# EAGLE board PinHeck (EAGLE 6.5.0), part 1 of 2
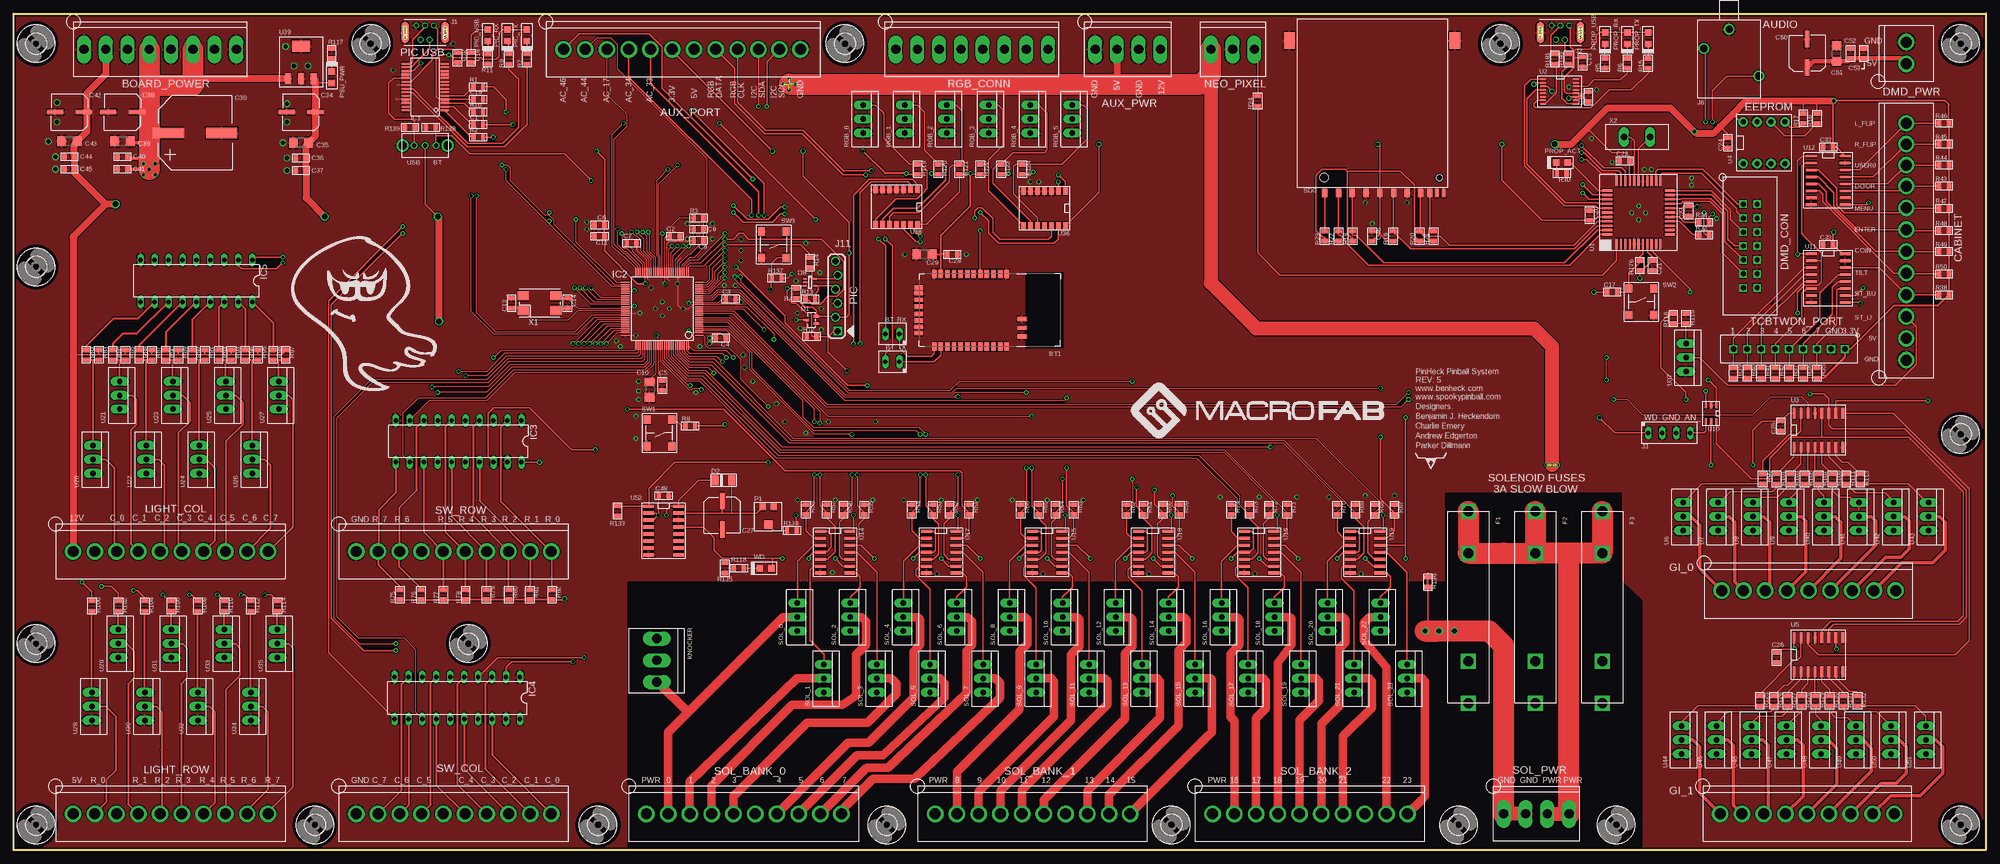
[diagram p10: board, top side]
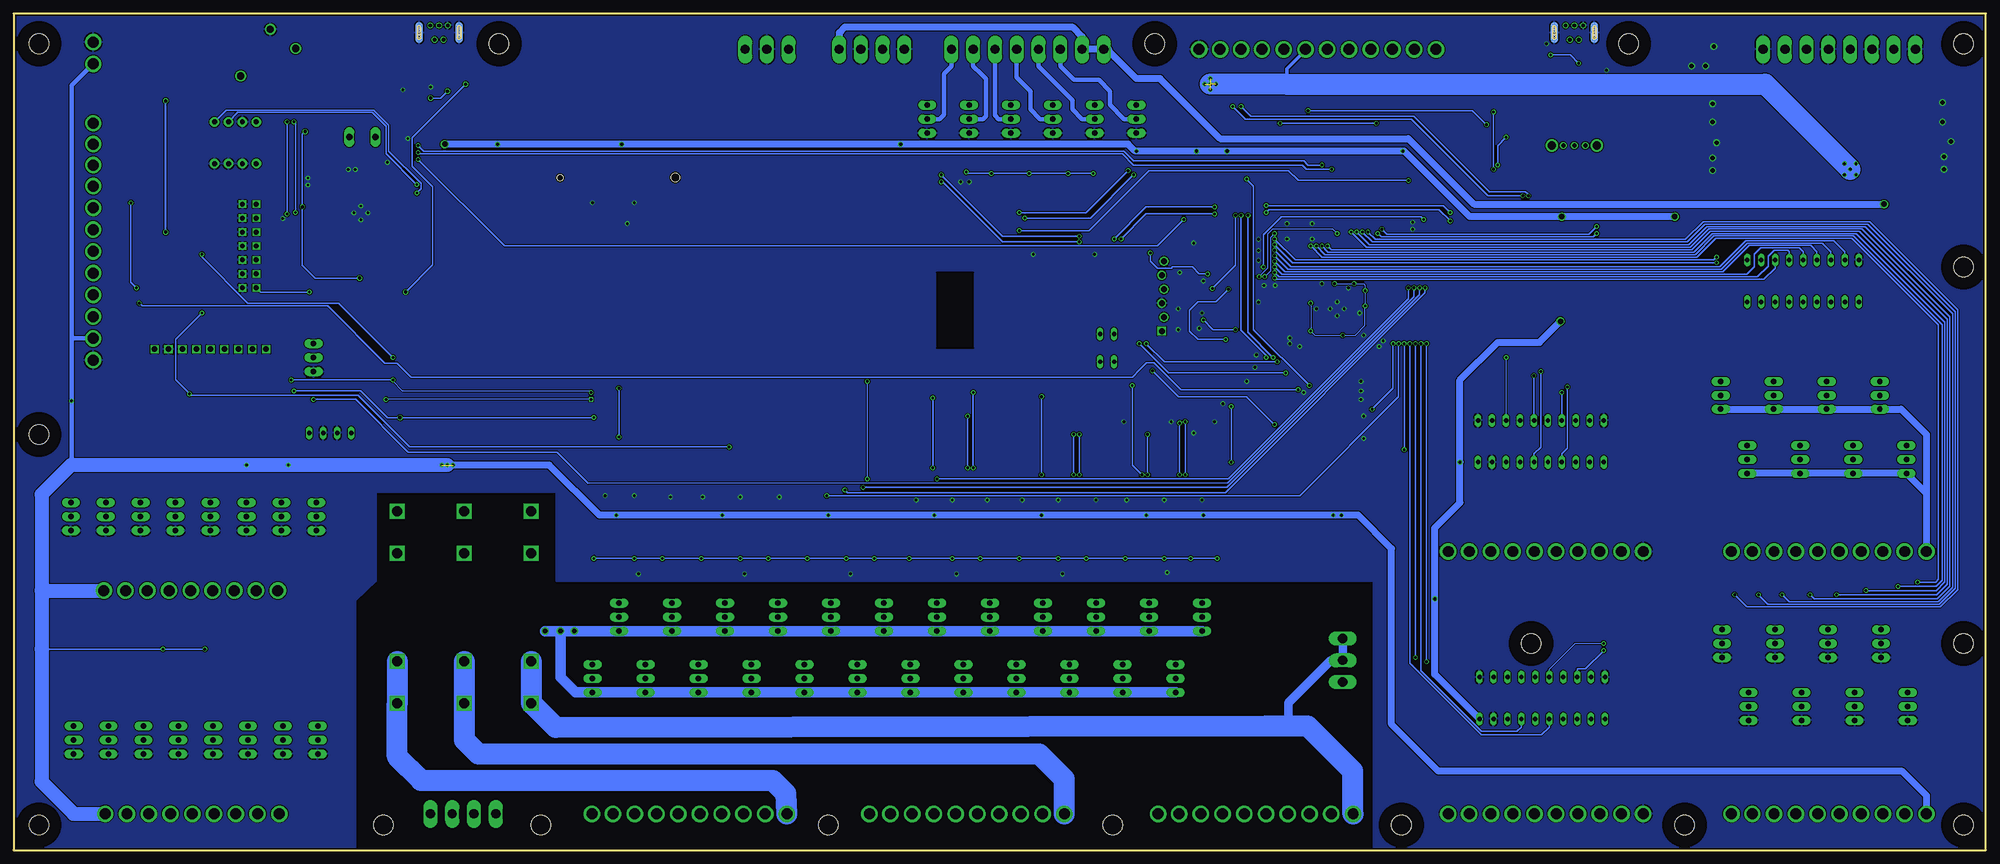
[diagram p11: board, bottom side, seen from below]

Size 359.16 x 152.27 mm. Coordinates in mm from the lower left corner, seen from the top.
Outline: 0,152.27 359.16,152.27 359.16,0 0,0 0,152.27
Copper layers (1*16): Top 0.035mm / dielectric 0.2mm / Bottom 0.035mm
Design rules "Seeed_2_Layer_DRU": minimum track width 6mil, minimum drill 12mil, track to track 6mil, track to pad 6mil, pad to pad 6mil, via to via 6mil, smd to smd 0mil, copper to edge 10mil, drill to drill 10mil, minimum pad ring 6mil, minimum via ring 6mil, stop-mask expansion 2mil, vias tented up to drill 25mil, thermal gap 10mil
Net classes: 0 default: width 0.178 mm, drill 0.5 mm, clearance 0.178 mm
tRestrict: area 184.4,91.4 to 191,105.2
bRestrict: area 184.4,91.4 to 191,105.2

## Footprints (pad centres in the part's own frame; a part is rotated, then mirrored left to right if it is on the bottom)
MOLEX_KK_12 = drill 2: P$1 -21.793,0; P$2 -17.831,0; P$3 -13.868,0; P$4 -9.906,0; P$5 -5.944,0; P$6 -1.981,0; P$7 1.981,0; P$8 5.944,0; P$9 9.906,0; P$10 13.716,0; P$11 17.526,0; P$12 21.336,0
MOLEX_KK_4 = drill 1.702 long: 1 -6.248,0; 2 -2.286,0; 3 1.676,0; 4 5.639,0
MOLEX_KK_8 = drill 1.702 long: 1 -13.868,0; 2 -9.906,0; 3 -5.944,0; 4 -1.981,0; 5 1.981,0; 6 5.944,0; 7 9.906,0; 8 13.868,0
RN-41 = smd 0.8 x 1.6: 1 -2.79,-6.6; 2 -1.59,-6.6; 3 -0.39,-6.6; 4 0.81,-6.6; 5 2.01,-6.6; 6 3.21,-6.6; 7 4.41,-6.6; 8 5.61,-6.6; 9 6.81,-6.6; 10 8.01,-6.6; 11 9.21,-6.6; 12 10.41,-6.6; 13 10.41,6.6; 14 9.21,6.6; 15 8.01,6.6; 16 6.81,6.6; 17 5.61,6.6; 18 4.41,6.6; 19 3.21,6.6; 20 2.01,6.6; 21 0.81,6.6; 22 -0.39,6.6; 23 -1.59,6.6; 24 -2.79,6.6 | smd 1.6 x 0.8: 25 -5.59,4.8; 26 -5.59,3.2; 27 -5.59,1.6; 28 13.21,3.1; 29 13.21,-3.1; 30 13.21,-4.122; 31 13.21,-1.9; 32 13.21,-0.7; 33 13.21,0.7; 34 13.21,1.9; 35 13.21,4.122
HEADER_01X02_PTH = drill 0.8 long: 1 0,0; 2 2.54,0
0805 = smd 0.8 x 1.2: 1 -0.9,0; 2 0.9,0
1206 = smd 1.6 x 1.8: 1 -1.4,0; 2 1.4,0
6.3MM_CAP_SMD = smd 0.8 x 3: NEG 0,-2.6; POS 0,2.6
CP12.5MM = smd 2 x 5.7: P$1 0,-4.85; P$2 0,4.85
SOT-323 = smd 0.5 x 1: 1 -0.65,-0.9; 2 0.65,-0.9; 3 0,0.9
SOD-123 = smd 1.3 x 1.8: 1 -1.27,0; 2 1.73,0
SOT-323-5 = smd 0.4 x 0.6: 1 -0.65,-0.9; 2 0,-0.9; 3 0.65,-0.9; 4 0.65,0.9; 5 -0.65,0.9
HEADER_02X07_PTH = drill 0.9 square: 1 -7.62,-1.27; 2 -5.08,-1.27; 3 -2.54,-1.27; 4 0,-1.27; 5 2.54,-1.27; 6 5.08,-1.27; 7 7.62,-1.27; 8 7.62,1.27; 9 5.08,1.27; 10 2.54,1.27; 11 0,1.27; 12 -2.54,1.27; 13 -5.08,1.27; 14 -7.62,1.27
MOLEX_KK_2 = drill 2: P$1 -1.88,0; P$2 2.083,0
4245K = drill 1.8 square: 1A -17.465,0; 1B -9.845,0; 2A 17.465,0; 2B 9.845,0
MOLEX_KK_9 = drill 2: P$1 -15.85,0; P$2 -11.887,0; P$3 -7.925,0; P$4 -3.962,0; P$5 0,0; P$6 3.962,0; P$7 7.925,0; P$8 11.887,0; P$9 15.85,0
3,6 = hole 3.6: 0,0
SSOP28L = smd 0.4 x 1.5: 1 -4.225,-3.575; 2 -3.575,-3.575; 3 -2.925,-3.575; 4 -2.275,-3.575; 5 -1.625,-3.575; 6 -0.975,-3.575; 7 -0.325,-3.575; 8 0.325,-3.575; 9 0.975,-3.575; 10 1.625,-3.575; 11 2.275,-3.575; 12 2.925,-3.575; 13 3.575,-3.575; 14 4.225,-3.575; 15 4.225,3.575; 16 3.575,3.575; 17 2.925,3.575; 18 2.275,3.575; 19 1.625,3.575; 20 0.975,3.575; 21 0.325,3.575; 22 -0.325,3.575; 23 -0.975,3.575; 24 -1.625,3.575; 25 -2.275,3.575; 26 -2.925,3.575; 27 -3.575,3.575; 28 -4.225,3.575
TQ100-PT = smd 1.5 x 0.2: 1 -6.7,4.8; 2 -6.7,4.4; 3 -6.7,4; 4 -6.7,3.6; 5 -6.7,3.2; 6 -6.7,2.8; 7 -6.7,2.4; 8 -6.7,2; 9 -6.7,1.6; 10 -6.7,1.2; 11 -6.7,0.8; 12 -6.7,0.4; 13 -6.7,0; 14 -6.7,-0.4; 15 -6.7,-0.8; 16 -6.7,-1.2; 17 -6.7,-1.6; 18 -6.7,-2; 19 -6.7,-2.4; 20 -6.7,-2.8; 21 -6.7,-3.2; 22 -6.7,-3.6; 23 -6.7,-4; 24 -6.7,-4.4; 25 -6.7,-4.8; 51 6.7,-4.8; 52 6.7,-4.4; 53 6.7,-4; 54 6.7,-3.6; 55 6.7,-3.2; 56 6.7,-2.8; 57 6.7,-2.4; 58 6.7,-2; 59 6.7,-1.6; 60 6.7,-1.2; 61 6.7,-0.8; 62 6.7,-0.4; 63 6.7,0; 64 6.7,0.4; 65 6.7,0.8; 66 6.7,1.2; 67 6.7,1.6; 68 6.7,2; 69 6.7,2.4; 70 6.7,2.8; 71 6.7,3.2; 72 6.7,3.6; 73 6.7,4; 74 6.7,4.4; 75 6.7,4.8 | smd 0.2 x 1.5: 26 -4.8,-6.7; 27 -4.4,-6.7; 28 -4,-6.7; 29 -3.6,-6.7; 30 -3.2,-6.7; 31 -2.8,-6.7; 32 -2.4,-6.7; 33 -2,-6.7; 34 -1.6,-6.7; 35 -1.2,-6.7; 36 -0.8,-6.7; 37 -0.4,-6.7; 38 0,-6.7; 39 0.4,-6.7; 40 0.8,-6.7; 41 1.2,-6.7; 42 1.6,-6.7; 43 2,-6.7; 44 2.4,-6.7; 45 2.8,-6.7; 46 3.2,-6.7; 47 3.6,-6.7; 48 4,-6.7; 49 4.4,-6.7; 50 4.8,-6.7; 76 4.8,6.7; 77 4.4,6.7; 78 4,6.7; 79 3.6,6.7; 80 3.2,6.7; 81 2.8,6.7; 82 2.4,6.7; 83 2,6.7; 84 1.6,6.7; 85 1.2,6.7; 86 0.8,6.7; 87 0.4,6.7; 88 0,6.7; 89 -0.4,6.7; 90 -0.8,6.7; 91 -1.2,6.7; 92 -1.6,6.7; 93 -2,6.7; 94 -2.4,6.7; 95 -2.8,6.7; 96 -3.2,6.7; 97 -3.6,6.7; 98 -4,6.7; 99 -4.4,6.7; 100 -4.8,6.7
DIL20 = drill 0.813 long: 1 -11.43,-3.81; 2 -8.89,-3.81; 3 -6.35,-3.81; 4 -3.81,-3.81; 5 -1.27,-3.81; 6 1.27,-3.81; 7 3.81,-3.81; 8 6.35,-3.81; 9 8.89,-3.81; 10 11.43,-3.81; 11 11.43,3.81; 12 8.89,3.81; 13 6.35,3.81; 14 3.81,3.81; 15 1.27,3.81; 16 -1.27,3.81; 17 -3.81,3.81; 18 -6.35,3.81; 19 -8.89,3.81; 20 -11.43,3.81
DIL18 = drill 0.813 long: 1 -10.16,-3.81; 2 -7.62,-3.81; 3 -5.08,-3.81; 4 -2.54,-3.81; 5 0,-3.81; 6 2.54,-3.81; 7 5.08,-3.81; 8 7.62,-3.81; 9 10.16,-3.81; 10 10.16,3.81; 11 7.62,3.81; 12 5.08,3.81; 13 2.54,3.81; 14 0,3.81; 15 -2.54,3.81; 16 -5.08,3.81; 17 -7.62,3.81; 18 -10.16,3.81
500075-1517 = drill 0.7: 5V -1.6,-1.3; D+ 0,-1.3; D- -0.8,1.3; GND 1.6,-1.3; ID 0.8,1.3 | smd 1.4 x 3.9: P$1 -3.65,0; P$2 3.65,0 | smd 1.4 x 3.9 bottom: P$3 -3.65,0; P$4 3.65,0 | hole 0.6: -3.65,0; -3.65,0; 3.65,0; 3.65,0.3; 3.65,0.6; 3.65,0.9; 3.65,-0.3; 3.65,-0.6; 3.65,-0.9; -3.65,0.6; -3.65,0.9; -3.65,-0.3; -3.65,-0.6; -3.65,-0.9
HEADER_01X04_PTH = drill 0.8 long: 1 0,0; 2 2.54,0; 3 5.08,0; 4 7.62,0
161-3507-E = drill 1.3: 1 1.7,0; 2 10.2,5.4; 5 5.2,-4.6
HDR-1X6_OFFSET = drill 1.067 square: 1 -0.203,6.35 | drill 1.067: 2 0.203,3.81; 3 -0.203,1.27; 4 0.203,-1.27; 5 -0.203,-3.81; 6 0.203,-6.35
MOLEX_KK_3 = drill 1.702 long: 1 -3.708,0; 2 0.254,0; 3 4.216,0
MOLEX_KK_10 = drill 2: P$1 -17.12,0; P$2 -13.157,0; P$3 -9.195,0; P$4 -5.232,0; P$5 -1.27,0; P$6 2.692,0; P$7 6.655,0; P$8 10.617,0; P$9 14.58,0; P$10 18.39,0
TC33_TRIMMER = smd 1.2 x 1.2: 1 -1,-1.8; 3 1,-1.8 | smd 1.6 x 1.5: 2 0,1.45
LED_0805 = smd 1.2 x 1.2: ANODE 1.05,0; CATHODE -1.05,0
TO-220AB = drill 1 pad 1.676 long: D 0,0; G 2.54,0; S -2.54,0
SD-RSMT-2-MQ = smd 1 x 1.5: 1 6.88,0; 2 4.38,0; 3 1.88,0; 4 -0.62,0; 5 -3.12,0; 6 -5.62,0; 7 -8.05,0; 8 -9.75,0; 9 9.38,0 | smd 0.7 x 1.5: CARD_DETECT -11.05,0; WP -12.25,0 | smd 2 x 3: GND_1 -14.28,-27.75; GND_2 15.82,-27.75 | hole 1.6: 9.5,-2.8 | hole 1.1: -11.5,-2.8
TACT6MM = smd 1.55 x 1.3: P$1 -2.425,2.25; P$2 2.425,2.25; P$3 2.425,-2.25; P$4 -2.425,-2.25
0S102011MS2QS1 = drill 0.8: 1 -2.007,0; 2 0,0; 3 2.007,0 | drill 1.5: P$4 -4.102,0; P$5 4.102,0
HEADER_01X09_PTH = drill 1 square: 1 -10.16,0; 2 -7.62,0; 3 -5.08,0; 4 -2.54,0; 5 0,0; 6 2.54,0; 7 5.08,0; 8 7.62,0; 9 10.16,0
LQFP-44 = smd 1.9 x 0.4: 1 -5.7,4; 2 -5.7,3.2; 3 -5.7,2.4; 4 -5.7,1.6; 5 -5.7,0.8; 6 -5.7,0; 7 -5.7,-0.8; 8 -5.7,-1.6; 9 -5.7,-2.4; 10 -5.7,-3.2; 11 -5.7,-4; 23 5.7,-4; 24 5.7,-3.2; 25 5.7,-2.4; 26 5.7,-1.6; 27 5.7,-0.8; 28 5.7,0; 29 5.7,0.8; 30 5.7,1.6; 31 5.7,2.4; 32 5.7,3.2; 33 5.7,4 | smd 0.4 x 1.9: 12 -4,-5.7; 13 -3.2,-5.7; 14 -2.4,-5.7; 15 -1.6,-5.7; 16 -0.8,-5.7; 17 0,-5.7; 18 0.8,-5.7; 19 1.6,-5.7; 20 2.4,-5.7; 21 3.2,-5.7; 22 4,-5.7; 34 4,5.7; 35 3.2,5.7; 36 2.4,5.7; 37 1.6,5.7; 38 0.8,5.7; 39 0,5.7; 40 -0.8,5.7; 41 -1.6,5.7; 42 -2.4,5.7; 43 -3.2,5.7; 44 -4,5.7
SSOP-16 = smd 0.305 x 1.016: 1 -1.905,-3.175; 2 -1.27,-3.175; 3 -0.635,-3.175; 4 0,-3.175; 5 0.635,-3.175; 6 1.27,-3.175; 7 1.905,-3.175; 8 2.54,-3.175; 9 2.54,2.819; 10 1.905,2.819; 11 1.27,2.819; 12 0.635,2.819; 13 0,2.819; 14 -0.635,2.819; 15 -1.27,2.819; 16 -1.905,2.819
SO-16 = smd 0.5 x 2: 1 -4.445,-3.1; 2 -3.175,-3.1; 3 -1.905,-3.1; 4 -0.635,-3.1; 5 0.635,-3.1; 6 1.905,-3.1; 7 3.175,-3.1; 8 4.445,-3.1; 9 4.445,3.1; 10 3.175,3.1; 11 1.905,3.1; 12 0.635,3.1; 13 -0.635,3.1; 14 -1.905,3.1; 15 -3.175,3.1; 16 -4.445,3.1
DIP-8 = drill 0.9 pad 1.727: 1 -3.81,-3.81; 2 -1.27,-3.81; 3 1.27,-3.81; 4 3.81,-3.81; 5 3.81,3.81; 6 1.27,3.81; 7 -1.27,3.81; 8 -3.81,3.81
TTSOP-6 = smd 0.4 x 1.2: 1 -0.95,-1.5; 2 0,-1.5; 3 0.95,-1.5; 4 0.95,1.5; 5 0,1.5; 6 -0.95,1.5
SOIC-14 = smd 0.6 x 2: 1 -4.445,-2.66; 2 -3.175,-2.66; 3 -1.905,-2.66; 4 -0.635,-2.66; 5 0.635,-2.66; 6 1.905,-2.66; 7 3.175,-2.66; 8 3.175,2.66; 9 1.905,2.66; 10 0.635,2.66; 11 -0.635,2.66; 12 -1.905,2.66; 13 -3.175,2.66; 14 -4.445,2.66
SOP-14 = smd 0.9 x 1.3: 1 -3.81,-3.15; 2 -2.54,-3.15; 3 -1.27,-3.15; 4 0,-3.15; 5 1.27,-3.15; 6 2.54,-3.15; 7 3.81,-3.15; 8 3.81,3.15; 9 2.54,3.15; 10 1.27,3.15; 11 0,3.15; 12 -1.27,3.15; 13 -2.54,3.15; 14 -3.81,3.15
SOT-223 = smd 1.1 x 2: COM1 0,0; IN -2.3,0; OUT 2.3,0 | smd 3.3 x 2: COM2 0,5.9
SOIC-16 = smd 0.6 x 2: 1 -4.445,-2.7; 2 -3.175,-2.7; 3 -1.905,-2.7; 4 -0.635,-2.7; 5 0.635,-2.7; 6 1.905,-2.7; 7 3.175,-2.7; 8 4.445,-2.7; 9 4.445,2.7; 10 3.175,2.7; 11 1.905,2.7; 12 0.635,2.7; 13 -0.635,2.7; 14 -1.905,2.7; 15 -3.175,2.7; 16 -4.445,2.7
FQ7050B = smd 2.1 x 1.7: 1 -2.95,-1.35; 2 2.95,-1.35; 3 2.95,1.35; 4 -2.95,1.35
HC-49/US_PTH = drill 1.2 long: P$1 -2.4,0; P$2 2.4,0

## Placement (x,y rotation side)
AUX_PORT  26-60-4120  [MOLEX_KK_12]  121.92,145.8 0 top
AUX_PWR  26-60-4040  [MOLEX_KK_4]  203.2,145.8 0 top
BOARD_POWER  [MOLEX_KK_8]  26.67,145.8 0 top
BT1  RN-41  [RN-41]  178.05,98.3 180 top
BT_RX  [HEADER_01X02_PTH]  161.29,93.98 180 top
BT_TX  [HEADER_01X02_PTH]  161.29,88.9 180 top
C1  .1uF  [0805]  84.58,132.08 0 top
C2  .1uF  [0805]  120.4,111.76 0 top
C3  .1uF  [0805]  130.56,100.33 0 top
C4  .1uF  [0805]  128.78,93.22 180 top
C5  .1uF  [0805]  118.11,84.58 270 top
C6  .1uF  [0805]  106.68,113.79 180 top
C7  .1uF  [0805]  112.52,110.49 0 top
C8  1uF  [0805]  124.71,113.03 180 top
C9  .1uF  [0805]  124.71,111 180 top
C10  10uF  [1206]  115.82,83.82 270 top
C11  .1uF  [0805]  106.68,111.76 180 top
C12  .1uF  [0805]  80.77,144.27 270 top
C13  30pF  [0805]  90.68,99.57 90 top
C14  30pF  [0805]  100.84,99.57 270 top
C15  .1uF  [0805]  285.75,143.51 270 top
C16  .1uF  [0805]  286.77,137.16 90 top
C17  .1uF  [0805]  291.08,101.6 0 top
C18  .1uF  [0805]  83.31,144.27 270 top
C19  .1uF  [0805]  84.58,136.65 0 top
C20  .1uF  [0805]  287.02,115.57 270 top
C21  .1uF  [0805]  298.45,106.43 90 top
C22  .1uF  [0805]  293.37,125.48 0 top
C23  .1uF  [0805]  305.05,116.33 90 top
C24  .1uF  [0805]  312.17,128.78 90 top
C25  .1uF  [0805]  321.82,77.22 90 top
C26  .1uF  [0805]  321.06,35.05 90 top
C27  EEE-1VA101XP  [6.3MM_CAP_SMD]  129.03,60.96 0 top
C28  .1uF  [0805]  170.94,108.46 180 top
C29  10uF  [1206]  165.86,108.46 180 top
C30  [CP12.5MM]  33.02,130.56 270 top
C32  .1uF  [0805]  330.45,128.02 0 top
C33  .1uF  [0805]  330.45,110.24 0 top
C34  EEE-1VA101XP  [6.3MM_CAP_SMD]  52.32,134.37 270 top
C35  10uF  [1206]  52.32,128.78 180 top
C36  1uF  [0805]  52.32,125.98 180 top
C37  .1uF  [0805]  52.32,123.7 180 top
C38  EEE-1VA101XP  [6.3MM_CAP_SMD]  19.81,134.37 270 top
C39  10uF  [1206]  19.81,129.03 180 top
C40  1uF  [0805]  19.81,126.24 180 top
C41  .1uF  [0805]  19.81,123.95 180 top
C42  EEE-1VA101XP  [6.3MM_CAP_SMD]  10.16,134.37 270 top
C43  10uF  [1206]  10.16,129.03 180 top
C44  1uF  [0805]  10.16,126.24 180 top
C45  .1uF  [0805]  10.16,123.95 180 top
C46  .1uF  [0805]  247.4,111.76 270 top
C48  1uF  [0805]  118.36,64.52 0 top
C50  EEE-1VA101XP  [6.3MM_CAP_SMD]  326.61,145.07 180 top
C51  10uF  [1206]  331.98,145.03 90 top
C52  1uF  [0805]  334.52,145.03 90 top
C53  .1uF  [0805]  336.93,145.03 90 top
CABINET  26-60-4120  [MOLEX_KK_12]  344.68,111 90 top
D1  BAV99W,115  [SOT-323]  145.29,96.52 90 top
D2  CGRM4001-HF  [SOD-123]  129.03,67.31 0 top
D8  NSQA6V8AW5T2G  [SOT-323-5]  145.03,103.38 270 top
DMD_CON  1-1634688-4  [HEADER_02X07_PTH]  316.23,109.98 270 top
DMD_PWR  26-60-4020  [MOLEX_KK_2]  344.68,145.03 90 top
F1  4245K  [4245K]  264.92,44.2 270 top
F2  4245K  [4245K]  277.11,44.2 270 top
F3  4245K  [4245K]  289.31,44.2 270 top
GI_0  26-60-4090  [MOLEX_KK_9]  326.9,47.24 0 top
GI_1  26-60-4090  [MOLEX_KK_9]  326.64,6.6 0 top
H1  MOUNT-HOLE3.6  [3,6]  4.06,4.57 0 top
H2  MOUNT-HOLE3.6  [3,6]  54.86,4.57 0 top
H3  MOUNT-HOLE3.6  [3,6]  106.43,4.57 0 top
H4  MOUNT-HOLE3.6  [3,6]  159,4.57 0 top
H5  MOUNT-HOLE3.6  [3,6]  210.82,4.57 0 top
H6  MOUNT-HOLE3.6  [3,6]  263.14,4.57 0 top
H7  MOUNT-HOLE3.6  [3,6]  291.85,4.57 0 top
H8  MOUNT-HOLE3.2  [3,6]  354.58,4.57 0 top
H9  MOUNT-HOLE3.2  [3,6]  354.58,75.69 0 top
H10  MOUNT-HOLE3.2  [3,6]  354.58,146.81 0 top
H12  MOUNT-HOLE3.2  [3,6]  270.76,146.81 0 top
H13  MOUNT-HOLE3.2  [3,6]  151.38,146.81 0 top
H14  MOUNT-HOLE3.2  [3,6]  65.02,146.81 0 top
H15  MOUNT-HOLE3.2  [3,6]  4.06,146.81 0 top
H16  MOUNT-HOLE3.2  [3,6]  4.06,106.17 0 top
H17  MOUNT-HOLE3.2  [3,6]  4.06,37.59 0 top
H18  MOUNT-HOLE3.6  [3,6]  82.8,37.59 0 top
IC1  FT232RL-REEL  [SSOP28L]  74.93,138.94 90 top
IC2  PIC32MX795F512L-80I/PT  [TQ100-PT]  118.11,98.55 180 top
IC3  CD74HCT244E  [DIL20]  81.03,74.42 180 top
IC4  CD74HCT244E  [DIL20]  80.77,27.69 180 top
IC5  ULN2803A  [DIL18]  33.27,103.63 180 top
J1  500075-1517  [500075-1517]  74.93,148.84 180 top
J2  500075-1517  [500075-1517]  281.69,148.84 180 top
J3  N/A  [HEADER_01X04_PTH]  297.69,75.95 0 top
J6  161-3507-E  [161-3507-E]  312.42,151.13 270 top
J11  No Load  [HDR-1X6_OFFSET]  149.86,100.84 180 top
KNOCKER  26-64-4030  [MOLEX_KK_3]  117.09,34.8 270 top
LIGHT_COL  26-64-4100  [MOLEX_KK_10]  27.94,54.36 0 top
LIGHT_ROW  26-64-4100  [MOLEX_KK_10]  27.94,6.6 0 top
LOGO1  SPOOKY_LOGOSPOOKY_LOGO  [SPOOKY_LOGO]  50.55,83.57 0 top
NEO_PIXEL  26-64-4030  [MOLEX_KK_3]  221.74,145.8 0 top
P1  TC33X-2-103E  [TC33_TRIMMER]  137.41,60.71 180 top
PIC_RX  LG R971-KN-1  [LED_0805]  89.92,148.34 90 top
PIC_TX  LG R971-KN-1  [LED_0805]  93.47,148.34 90 top
PIC_USB  LG R971-KN-1  [LED_0805]  86.36,148.34 90 top
PROP_ACT  LG R971-KN-1  [LED_0805]  281.94,125.22 0 top
PROP_RX  LG R971-KN-1  [LED_0805]  293.88,147.83 90 top
PROP_TX  LG R971-KN-1  [LED_0805]  297.69,147.83 90 top
PROP_USB  LG R971-KN-1  [LED_0805]  289.81,147.83 90 top
PSU_PWR  LG R971-KN-1  [LED_0805]  57.91,140.72 270 top
R1  1K  [0805]  84.58,138.94 0 top
R2  1K  [0805]  84.58,129.79 0 top
R3  0  [0805]  124.71,115.06 0 top
R4  10K  [0805]  142.49,101.35 270 top
R5  360  [0805]  289.81,143.26 90 top
R6  360  [0805]  293.88,143.26 90 top
R7  360  [0805]  93.47,144.02 90 top
R8  200  [0805]  123.19,77.22 0 top
R9  360  [0805]  90.17,144.02 90 top
R10  100  [0805]  84.58,134.37 0 top
R11  360  [0805]  86.36,144.02 90 top
R12  50  [0805]  145.29,93.47 0 top
R13  50  [0805]  145.03,100.33 0 top
R14  50  [0805]  145.03,106.93 270 top
R15  360  [0805]  297.69,143.26 90 top
R16  10K  [0805]  328.42,133.19 90 top
R17  10K  [0805]  325.91,133.22 90 top
R18  10K  [0805]  243.84,111.76 90 top
R19  10K  [0805]  251.21,111.76 90 top
R20  10K  [0805]  256.03,111.76 90 top
R21  10K  [0805]  258.57,111.76 90 top
R22  10K  [0805]  241.3,111.76 90 top
R23  10K  [0805]  238.76,111.76 90 top
R24  360  [0805]  226.57,136.4 90 top
R30  360  [0805]  281.94,123.19 180 top
R32  4.7K  [0805]  307.85,112.01 0 top
R34  4.7K  [0805]  307.85,114.3 0 top
R35  10K  [0805]  328.42,86.87 270 top
R36  10K  [0805]  325.88,86.87 270 top
R37  10K  [0805]  323.34,86.87 270 top
R38  10K  [0805]  351.54,101.09 0 top
R39  10K  [0805]  313.18,86.87 270 top
R40  10K  [0805]  315.72,86.87 270 top
R41  10K  [0805]  318.26,86.87 270 top
R42  10K  [0805]  320.8,86.87 270 top
R43  10K  [0805]  351.54,120.9 0 top
R44  10K  [0805]  351.54,124.71 0 top
R45  10K  [0805]  351.54,128.52 0 top
R46  10K  [0805]  351.54,132.33 0 top
R47  10K  [0805]  351.54,116.84 0 top
R48  10K  [0805]  351.54,112.78 0 top
R49  10K  [0805]  351.54,108.97 0 top
R50  10K  [0805]  351.54,104.9 0 top
R51  10K  [0805]  173.99,61.98 270 top
R52  10K  [0805]  170.43,61.98 270 top
R53  10K  [0805]  167.39,61.98 270 top
R54  10K  [0805]  163.58,61.98 270 top
R55  10K  [0805]  154.94,61.98 270 top
R56  10K  [0805]  151.13,61.98 270 top
R57  10K  [0805]  148.08,61.98 270 top
R58  10K  [0805]  144.27,61.98 270 top
R59  10K  [0805]  212.34,61.98 270 top
R60  10K  [0805]  209.3,61.98 270 top
R61  10K  [0805]  205.74,61.98 270 top
R62  10K  [0805]  202.69,61.98 270 top
R63  10K  [0805]  193.04,61.98 270 top
R64  10K  [0805]  189.74,61.98 270 top
R65  10K  [0805]  186.69,61.98 270 top
R66  10K  [0805]  183.39,61.98 270 top
R67  10K  [0805]  251.46,61.98 270 top
R68  10K  [0805]  247.9,61.98 270 top
R69  10K  [0805]  244.35,61.98 270 top
R70  10K  [0805]  241.05,61.98 270 top
R71  10K  [0805]  231.9,61.98 270 top
R72  10K  [0805]  228.6,61.98 270 top
R73  10K  [0805]  225.04,61.98 270 top
R74  10K  [0805]  221.74,61.98 270 top
R75  10K  [0805]  70.36,46.48 90 top
R76  10K  [0805]  74.17,46.48 90 top
R77  10K  [0805]  78.23,46.48 90 top
R78  10K  [0805]  82.3,46.48 90 top
R79  10K  [0805]  86.11,46.48 270 top
R80  10K  [0805]  90.17,46.48 270 top
R81  10K  [0805]  93.98,46.48 270 top
R82  10K  [0805]  98.04,46.48 270 top
R83  10K  [0805]  15.49,90.17 270 top
R84  360  [0805]  13.21,90.17 270 top
R85  10K  [0805]  20.32,90.17 270 top
R86  360  [0805]  18.03,90.17 270 top
R87  10K  [0805]  25.15,90.17 270 top
R88  360  [0805]  22.86,90.17 270 top
R89  10K  [0805]  29.97,90.17 270 top
R90  360  [0805]  27.69,90.17 270 top
R91  10K  [0805]  34.8,90.17 270 top
R92  360  [0805]  32.51,90.17 270 top
R93  10K  [0805]  39.62,90.17 270 top
R94  360  [0805]  37.34,90.17 270 top
R95  10K  [0805]  44.45,90.17 270 top
R96  360  [0805]  42.16,90.17 270 top
R97  10K  [0805]  49.53,90.17 270 top
R98  360  [0805]  47.24,90.17 270 top
R99  360  [0805]  318.52,67.56 270 top
R100  360  [0805]  14.22,44.45 270 top
R101  360  [0805]  321.06,67.56 270 top
R102  360  [0805]  19.05,44.45 270 top
R103  360  [0805]  323.6,67.56 270 top
R104  360  [0805]  23.88,44.45 270 top
R105  360  [0805]  326.14,67.56 270 top
R106  360  [0805]  28.7,44.45 270 top
R107  360  [0805]  328.68,67.56 270 top
R108  360  [0805]  33.53,44.45 270 top
R109  360  [0805]  331.22,67.56 270 top
R110  360  [0805]  38.35,44.45 270 top
R111  360  [0805]  333.76,67.56 270 top
R112  360  [0805]  43.18,44.45 270 top
R113  360  [0805]  336.3,67.56 270 top
R114  360  [0805]  48.01,44.45 270 top
R115  10K  [0805]  304.55,96.77 270 top
R116  360  [0805]  302.26,96.77 90 top
R117  360  [0805]  57.91,145.03 270 top
R118  360  [0805]  132.08,51.31 180 top
R119  10K  [0805]  164.59,123.95 270 top
R120  10K  [0805]  168.4,123.95 270 top
R121  10K  [0805]  172.21,123.95 270 top
R122  10K  [0805]  176.02,123.95 270 top
R123  10K  [0805]  179.83,123.95 270 top
R124  10K  [0805]  183.64,123.95 270 top
R125  360  [0805]  318.01,27.18 270 top
R126  360  [0805]  320.55,27.18 270 top
R127  360  [0805]  323.09,27.18 270 top
R128  360  [0805]  325.63,27.18 270 top
R129  360  [0805]  328.17,27.18 270 top
R130  360  [0805]  330.71,27.18 270 top
R131  360  [0805]  333.25,27.18 270 top
R132  360  [0805]  335.79,27.18 270 top
R133  10K  [0805]  109.98,61.72 270 top
R134  20K  [0805]  141.73,58.17 0 top
R135  10K  [0805]  129.54,51.31 270 top
R136  0  [0805]  257.56,48.77 270 top
R137  10K  [0805]  138.94,104.14 0 top
R138  10K  [0805]  75.95,131.57 0 top
R139  10K  [0805]  72.14,131.57 180 top
R176  10K  [0805]  296.16,106.43 270 top
R180  22  [0805]  283.21,144.02 90 top
R181  22  [0805]  280.67,144.02 90 top
RGB_0  RFP12N10L  [TO-220AB]  154.69,133.1 90 top
RGB_1  RFP12N10L  [TO-220AB]  162.31,133.1 90 top
RGB_2  RFP12N10L  [TO-220AB]  169.93,133.1 90 top
RGB_3  RFP12N10L  [TO-220AB]  177.55,133.1 90 top
RGB_4  RFP12N10L  [TO-220AB]  185.17,133.1 90 top
RGB_5  RFP12N10L  [TO-220AB]  192.79,133.1 90 top
RGB_CONN  26-60-4080  [MOLEX_KK_8]  174.5,145.8 0 top
SD0  SD-RSMT-2-MQ  [SD-RSMT-2-MQ]  248.16,119.63 180 top
SOL_0  IRL530PBF  [TO-220AB]  142.75,42.42 90 top
SOL_1  IRL530PBF  [TO-220AB]  147.57,31.24 90 top
SOL_2  IRL530PBF  [TO-220AB]  152.4,42.42 90 top
SOL_3  IRL530PBF  [TO-220AB]  157.23,31.24 90 top
SOL_4  IRL530PBF  [TO-220AB]  162.05,42.42 90 top
SOL_5  IRL530PBF  [TO-220AB]  166.88,31.24 90 top
SOL_6  IRL530PBF  [TO-220AB]  171.7,42.42 90 top
SOL_7  IRL530PBF  [TO-220AB]  176.53,31.24 90 top
SOL_8  IRL530PBF  [TO-220AB]  181.36,42.42 90 top
SOL_9  IRL530PBF  [TO-220AB]  186.18,31.24 90 top
SOL_10  IRL530PBF  [TO-220AB]  191.01,42.42 90 top
SOL_11  IRL530PBF  [TO-220AB]  195.83,31.24 90 top
SOL_12  IRL530PBF  [TO-220AB]  200.66,42.42 90 top
SOL_13  IRL530PBF  [TO-220AB]  205.49,31.24 90 top
SOL_14  IRL530PBF  [TO-220AB]  210.31,42.42 90 top
SOL_15  IRL530PBF  [TO-220AB]  215.14,31.24 90 top
SOL_16  IRL530PBF  [TO-220AB]  219.96,42.42 90 top
SOL_17  IRL530PBF  [TO-220AB]  224.79,31.24 90 top
SOL_18  IRL530PBF  [TO-220AB]  229.62,42.42 90 top
SOL_19  IRL530PBF  [TO-220AB]  234.44,31.24 90 top
SOL_20  IRL530PBF  [TO-220AB]  239.27,42.42 90 top
SOL_21  IRL530PBF  [TO-220AB]  244.09,31.24 90 top
SOL_22  IRL530PBF  [TO-220AB]  248.92,42.42 90 top
SOL_23  IRL530PBF  [TO-220AB]  253.75,31.24 90 top
SOL_BANK_0  26-64-4100  [MOLEX_KK_10]  132.33,6.6 0 top
SOL_BANK_1  26-64-4100  [MOLEX_KK_10]  184.91,6.6 0 top
SOL_BANK_2  26-64-4100  [MOLEX_KK_10]  235.46,6.6 0 top
SOL_PWR  26-60-4040  [MOLEX_KK_4]  277.62,6.6 0 top
SW1  [TACT6MM]  117.6,75.95 90 top
SW2  [TACT6MM]  296.42,99.82 270 top
SW3  [TACT6MM]  138.43,110.24 90 top
SW4  0S102011MS2QS1  [0S102011MS2QS1]  74.93,128.27 180 top
SW_COL  26-64-4100  [MOLEX_KK_10]  79.5,6.6 0 top
SW_ROW  26-64-4100  [MOLEX_KK_10]  79.5,54.36 0 top
TCBTWDN_PORT  N/A  [HEADER_01X09_PTH]  323.34,91.19 180 top
U1  P8X32A-Q44  [LQFP-44]  295.91,116.08 90 top
U2  FT230XS-R  [SSOP-16]  281.69,138.43 270 top
U3  74HC595D-Q100  [SO-16]  328.68,76.45 0 top
U4  24LC1025-I/P  [DIP-8]  318.77,128.78 0 top
U5  74HC595D-Q100  [SO-16]  328.68,35.56 0 top
U6  TIP102  [TO-220AB]  304.04,60.71 90 top
U7  TIP102  [TO-220AB]  310.39,60.71 90 top
U8  TIP102  [TO-220AB]  316.74,60.71 90 top
U9  TIP102  [TO-220AB]  323.34,60.71 90 top
U10  74HCT2G04GV,125  [TTSOP-6]  309.12,79.5 180 top
U11  74HC165D,652  [SO-16]  330.45,104.14 270 top
U12  74HC165D,652  [SO-16]  330.45,121.92 270 top
U14  MC74HC08ADG  [SOIC-14]  149.61,53.59 270 top
U15  MC74HC08ADG  [SOIC-14]  188.21,53.59 270 top
U16  MC74HC08ADG  [SOIC-14]  226.82,53.59 270 top
U17  MC74HC08ADG  [SOIC-14]  168.91,53.59 270 top
U18  MC74HC08ADG  [SOIC-14]  207.52,53.59 270 top
U19  MC74HC08ADG  [SOIC-14]  246.13,53.59 270 top
U20  TIP107  [TO-220AB]  14.48,71.12 90 top
U21  TIP107  [TO-220AB]  19.3,82.8 90 top
U22  TIP107  [TO-220AB]  24.13,71.12 90 top
U23  TIP107  [TO-220AB]  28.96,82.8 90 top
U24  TIP107  [TO-220AB]  33.78,71.12 90 top
U25  TIP107  [TO-220AB]  38.61,82.8 90 top
U26  TIP107  [TO-220AB]  43.43,71.12 90 top
U27  TIP107  [TO-220AB]  48.26,82.8 90 top
U28  TIP102  [TO-220AB]  14.22,26.16 90 top
U29  TIP102  [TO-220AB]  19.05,37.59 90 top
U30  TIP102  [TO-220AB]  23.88,26.16 90 top
U31  TIP102  [TO-220AB]  28.7,37.59 90 top
U32  TIP102  [TO-220AB]  33.53,26.16 90 top
U33  TIP102  [TO-220AB]  38.35,37.59 90 top
U34  TIP102  [TO-220AB]  43.18,26.16 90 top
U35  TIP102  [TO-220AB]  48.01,37.59 90 top
U36  WS2801  [SOP-14]  187.71,116.84 180 top
U37  TIP102  [TO-220AB]  304.55,89.66 90 top
U38  WS2801  [SOP-14]  160.78,117.09 180 top
U39  LM2937IMP-3.3/NOPB  [SOT-223]  52.32,140.46 0 top
U40  TIP102  [TO-220AB]  329.69,60.71 90 top
U41  TIP102  [TO-220AB]  336.04,60.71 90 top
U42  TIP102  [TO-220AB]  342.39,60.71 90 top
U43  TIP102  [TO-220AB]  348.74,60.71 90 top
U44  TIP102  [TO-220AB]  303.78,20.07 90 top
U45  TIP102  [TO-220AB]  310.13,20.07 90 top
U46  TIP102  [TO-220AB]  316.48,20.07 90 top
U47  TIP102  [TO-220AB]  322.83,20.07 90 top
U48  TIP102  [TO-220AB]  329.18,20.07 90 top
U49  TIP102  [TO-220AB]  335.53,20.07 90 top
U50  TIP102  [TO-220AB]  341.88,20.07 90 top
U51  TIP102  [TO-220AB]  348.23,20.07 90 top
U52  CD74HC123M96  [SOIC-16]  118.36,58.17 270 top
U$1  LHE_LOGOLHE_LOGO  [LHE_LOGO]  260.1,69.34 0 top
U$2  MF_LOGOLOGO_TEXT  [MF_LOGO_TEXT]  203.71,74.93 0 top
WD  LG R971-KN-1  [LED_0805]  136.91,51.31 0 top
X1  FQ7050B-8.000  [FQ7050B]  95.76,99.57 0 top
X2  ECS-65-20-4X  [HC-49/US_PTH]  295.66,129.79 0 top

## Tracks (layer width: path | path; a pad name or v marks a point on that pad's centre or on a via)
3.3V  (via drill 0.5, 0.6, 1)
  Top 0.178: 117.31,91.79 IC2.86 117.31,93.51 v117.09,93.73 | 294.29,121.8 294.29,121.1 | 288.92,115.28 U1.40 | C3.1 129.01,100.33 128.44,99.75 IC2.16 123.12,99.75 v122.94,99.57 | U36.14 191.52,113.24 | IC2.55 112.93,101.75 v113.03,101.85 | IC2.62 112.92,98.95 v113.03,99.06 | v115.06,103.12 114.91,103.28 IC2.46 114.91,106.83 112.78,108.97 112.78,109.34 C7.1 | v118.62,103.12 118.51,103.23 IC2.37 118.51,111.42 118.86,111.76 C2.1 119.5,113.4 121.16,115.06 R3.1 | v122.94,94.49 123.27,94.15 IC2.2 128.6,94.15 129.53,93.22 C4.1
  Top 0.203: 117.31,91.79 117.31,86.68 118.11,85.88 C5.1
  Top 0.254: 352.44,131.55 R45.2 R44.2 R43.2 R47.2 R48.2 R49.2 R50.2 R38.2 | 242.92,123.62 242.63,123.92 238.22,123.92 237.19,122.89 237.19,112.77 238.42,111.54 238.76,111.54 R23.1 R22.1 | 329.69,85.97 329.81,85.97 333.5,89.66 | U1.30 294.29,121.8 294.27,121.82 C22.2 294.27,126.35 293.62,127 291.08,127 286.64,131.44 | 288.92,115.28 288.51,115.28 287.9,114.67 C20.2 278.27,114.67 271.02,121.92 v271.02,128.52 | 242.92,123.62 242.92,112.12 243.5,111.54 243.84,111.54 R18.1 | 248.78,123.62 252.58,123.62 255.1,121.1 255.1,111.79 R20.1 R21.1 | D1.2 145.77,97.17 | J11.2 149.52,97.17 D1.2 | U1.8 297.51,108.95 298.45,108.01 C21.2 296.65,105.53 R176.2 v296.16,104.14 | U1.18 303.82,116.88 304.17,117.23 C23.2 306.44,117.23 v306.58,117.09 | R39.2 R40.2 R41.2 R42.2 R37.2 R36.2 R35.2 | C33.2 333,108.58 U11.16 | R4.2 144.13,98.81 145.54,98.81 146.19,98.16 D1.2 | 248.78,112.24 C46.2 | R19.1 250.16,110.86 248.78,112.24 | R119.2 162.7,123.05 v162.56,123.19 | v185.67,123.44 185.28,123.05 R124.2 | R123.2 179.97,123.19 v181.1,123.19 | 174.24,123.05 R121.2 172.21,119.89 166.27,113.94 U38.14 | R122.2 174.24,123.05 | 174.24,123.05 v174.24,123.19 | R120.2 167.39,123.05 v167.13,123.19 | 322.61,136.18 322.83,136.4 | 320.29,135.89 319.79,136.4 | U36.14 197.61,119.79 v197.61,128.52 | 248.78,123.62 248.78,128.52 v248.41,128.52 | 248.78,123.62 242.92,123.62 | 248.78,112.24 SD0.4 248.78,123.62 | R17.2 325.91,136.37 325.88,136.4 | R16.2 328.42,136.14 328.17,136.4 | U4.8 314.45,132.59 313.05,133.99 | C24.2 312.17,130.3 310.77,131.7 | PSU_PWR.ANODE 57.88,139.7 54.92,139.7 | R137.2 140.97,104.14 v141.73,104.9 | SW4.2 74.93,117.6 v77.22,115.32
  Top 0.305: v143.76,127.25 143.76,122.68 152.15,114.3 v152.15,108.71 152.15,97.54 151.64,97.03 J11.2 | IC3.20 v95.76,70.61
  Top 0.406: R75.1 R76.1 R77.1 R78.1 R79.2 R80.2 R81.2 R82.2 100.33,45.58 v100.33,45.72 | v106.17,127.25 107.7,125.73 107.7,113.91 C6.1 C11.1 107.58,109.08 113.54,103.12 v115.06,103.12 | AUX_PORT.P$6 119.94,145.49 v138.18,127.25 | 331.22,136.4 331.35,136.26 C32.2 331.9,128.02 U12.16 | C33.2 331.35,112.41 v331.47,112.52 | v331.47,136.4 351.79,136.4 352.44,135.75 R46.2 R38.2 350.4,99.06 342.39,99.06 334.52,91.19 TCBTWDN_PORT.1 333.5,89.78 329.69,85.97 R35.2 | v162.56,123.19 158.75,123.19 v154.69,127.25 | BT1.11 168.84,108.46 | 168.84,108.46 168.84,111.95 174.24,117.35 v174.24,123.19 | C29.1 168.84,108.46 | C28.2 168.84,108.46
  Top 1.27: U39.OUT 54.92,140.16 54.92,139.7 C34.POS 54.92,129.98 C35.1 53.22,128.28 C36.1 C37.1 53.22,118.73 v56.64,115.32 | v77.47,96.27 77.47,115.32 v77.22,115.32 | v280.67,128.52 283.72,128.52 286.64,131.44 290.32,135.13 301.75,135.13 v306.07,130.81 306.32,130.56 309.63,130.56 310.77,131.7 313.05,133.99 315.47,136.4 319.79,136.4 322.83,136.4 325.88,136.4 328.17,136.4 331.22,136.4 v331.47,136.4
  Bottom 0.178: v118.62,103.12 v115.06,103.12 113.28,103.12 113.03,102.87 v113.03,101.85 v113.03,99.06 113.03,95.52 114.83,93.73 v117.09,93.73 122.17,93.73 v122.94,94.49 v122.94,99.57
  Bottom 0.254: v162.56,123.19 v167.13,123.19 v174.24,123.19 v181.1,123.19 185.42,123.19 v185.67,123.44 | v306.07,130.81 306.58,130.3 v306.58,117.09 306.58,106.48 304.24,104.14 v296.16,104.14 | v141.73,104.9 143.26,104.9 144.53,106.17 148.08,106.17 148.34,105.92 150.88,105.92 152.15,107.19 v152.15,108.71
  Bottom 0.406: v331.47,112.52 v331.47,136.4
  Bottom 1.27: v56.64,115.32 v77.22,115.32 93.98,115.32 105.92,127.25 v106.17,127.25 v138.18,127.25 v143.76,127.25 v154.69,127.25 154.94,127.25 156.21,128.52 v197.61,128.52 v248.41,128.52 v271.02,128.52 v280.67,128.52 | v77.47,96.27 81.28,92.46 88.9,92.46 95.76,85.6 v95.76,70.61 95.76,63.25 100.33,58.67 v100.33,45.72 100.33,32 IC4.20
3V3OUT  (via drill 0.6 pad 0.9)
  Top 0.254: v283.21,136.91 283.46,137.16 U2.11 | U2.3 279.27,139.06 v280.16,138.18 | C16.1 285.87,137.16 U2.11 | U2.10 U2.11
  Bottom 0.254: v280.16,138.18 281.43,136.91 v283.21,136.91
5V  (via drill 0.5)  (6 unrouted)
  Top 0.254: U14.14 152.91,58.04 v152.91,60.96 | U17.14 171.96,58.04 v171.96,60.96 | U15.14 191.52,58.04 v191.52,60.96 | U18.14 210.82,58.04 v210.82,60.96 | U19.14 249.43,58.04 v249.43,60.96 | U16.14 230.12,58.04 v230.12,60.96 | U10.5 v309.12,70.1 | U3.10 331.85,81.66 331.98,81.79 v348.61,81.79 | v316.74,70.1 316.74,76.45 318.4,78.12 C25.2 323.26,79.55 U3.16 | U5.10 331.85,36.58 v331.98,36.58 | U5.16 324.23,36.58 v324.36,36.58 321.68,36.58 C26.2 | D2.1 124.71,67.31 121.06,63.66 U52.16 119.51,62.61 118.87,61.98 v118.87,60.96 | 116.2,60.07 U52.3 116.46,60.07 v117.35,60.96 | R134.2 142.49,58.3 v142.49,60.96 | v117.35,60.96 117.46,61.08 C48.1 | U52.2 116.97,61.34 v117.35,60.96 | v25.75,122.94 25.45,123.19 v24.69,123.95 | v25.75,124.97 25.2,124.97 24.69,124.46 | v23.62,124.97 23.67,124.97 v24.69,123.95 | v23.62,122.94 23.93,123.19 v24.69,123.95 | 34.23,140.46 34.23,140.21 32.61,140.21
  Top 0.406: U52.16 121.54,62.61 | C30.P$1 24.69,130.56 23.88,130.56
  Top 0.61: C38.POS 24.69,134.37 | C39.1 21.21,128.78 24.69,128.78 | C40.1 20.71,125.98 24.69,125.98 | C41.1 v24.69,123.95
  Top 0.813: C50.POS 327.78,143.63 C51.1 334.02,143.63 C52.1 C53.1 343.7,144.13 DMD_PWR.P$1
  Top 1.27: U39.IN 34.23,140.46 | AUX_PWR.2 200.91,139.45 200.91,138.94
  Top 2.54: 218.03,141.58 218.03,141.22 218.03,103.28 226.31,95 276.86,95 280.16,91.69 v280.16,70.1
  Top 3.81: v141.22,139.45 200.91,139.45 216.26,139.45 218.03,141.22 NEO_PIXEL.1 | BOARD_POWER.4 24.69,139.19 | 24.69,139.19 24.69,134.37 24.69,130.56 24.69,128.78 24.69,125.98 24.69,124.46 v24.69,123.95 24.64,123.95 | BOARD_POWER.6 32.61,140.21 32.61,139.19 24.69,139.19
  Bottom 0.254: 301.24,70.36 300.99,70.1 | 354.08,36.58 v331.98,36.58 v324.36,36.58 | AUX_PORT.P$7 124.46,145.8 | 127.25,139.7 127.51,139.45
  Bottom 0.61: 124.46,145.8 124.46,145.03 127.25,142.24 127.25,139.7
  Bottom 0.813: DMD_PWR.P$1 348.61,139.22 348.61,93.22 | 348.61,93.22 v348.61,81.79 348.61,70.23 348.49,70.1 | CABINET.P$2 348.56,93.17 348.61,93.22
  Bottom 1.27: v280.16,70.1 261.62,70.1 252.48,60.96 v249.43,60.96 v230.12,60.96 v210.82,60.96 v191.52,60.96 v171.96,60.96 v152.91,60.96 v142.49,60.96 v118.87,60.96 v117.35,60.96 114.3,60.96 108.2,54.86 108.2,22.86 99.76,14.41 15.3,14.41 10.82,9.93 LIGHT_ROW.P$1 | 348.49,70.1 348.74,70.1
  Bottom 2.54: v280.16,70.1 300.99,70.1 v309.12,70.1 v316.74,70.1 348.49,70.1 | 348.74,70.1 354.08,64.77 354.08,47.24 | 354.08,47.24 GI_0.P$9 | 354.08,47.24 354.08,36.58 354.08,12.45 348.23,6.6 GI_1.P$9
  Bottom 3.81: v141.22,139.45 127.51,139.45 40.18,139.45 v24.69,123.95
  other vias: 142.24,139.45 141.22,140.46 140.21,139.45 141.22,138.43 279.15,70.1 281.18,70.1
12V  (via drill 1)
  Top 0.254: 13.31,133.82 C42.POS | 15.49,90.17 20.32,90.17 | 20.32,90.17 25.15,90.17 | 25.15,90.17 29.97,90.17 | 29.97,90.17 34.8,90.17 | 34.8,90.17 39.62,90.17 | 39.62,90.17 44.45,90.17 | 44.45,90.17 48.77,90.17 49.53,90.93 R97.1 | R95.1 44.45,90.17 | R93.1 39.62,90.17 | R91.1 34.8,90.17 | R89.1 29.97,90.17 | R87.1 25.15,90.17 | R85.1 20.32,90.17 | 15.49,90.17 10.82,90.17 | R83.1 15.49,90.17
  Top 1.27: 16.76,117.6 v18.54,117.6 18.68,117.74 | 16.76,117.6 10.92,111.76 10.82,111.52 10.82,90.17 LIGHT_COL.P$1 | 16.76,117.6 11.06,123.31 C45.1 C44.1 11.06,128.53 C43.1 13.31,130.78 13.31,133.6 13.31,133.82 13.31,137.77 16.76,141.22 BOARD_POWER.2
  Bottom 1.27: U26.S U24.S U22.S U20.S 10.82,64.92 LIGHT_COL.P$1 10.82,75.69 15.39,80.26 U25.S | U27.S U25.S | U25.S U23.S U21.S | v18.54,117.6 93.22,117.6 105.16,129.54 139.45,129.54 150.37,140.46 154.69,140.46 159.77,145.54 159.77,145.8 RGB_CONN.1 RGB_CONN.2 164.59,148.08 166.37,149.86 207.77,149.86 208.79,148.84 208.79,145.85 AUX_PWR.4
50V
  Top 2.54: SOL_PWR.3 SOL_PWR.4
  Top 3.81: F2.1B 271.37,54.04 F1.1B F1.1A | F2.1A F2.1B | F3.1A F3.1B 283.26,54.04 | 283.26,54.04 F2.1B | SOL_PWR.4 283.26,54.04
50V_FUSE_0
  Bottom 1.524: KNOCKER.1 KNOCKER.2 119.24,34.54 127,26.78 127,22.61
  Bottom 3.81: F1.2B F1.2A 264.56,26.48 260.44,22.35 131.17,22.61 127,22.61 123.51,22.61 115.32,14.41 115.32,6.71 SOL_BANK_0.P$1
50V_FUSE_1
  Bottom 3.81: F2.2B F2.2A 277.11,20.07 274.57,17.53 172.4,17.53 167.79,12.92 SOL_BANK_1.P$1
50V_FUSE_2
  Bottom 3.81: F3.2B F3.2A 289.31,17.02 284.99,12.7 220.92,12.7 218.5,10.29 SOL_BANK_2.P$1
!AN_BLANK
  Top 0.254: U10.4 308.17,76.27 307.85,75.95 J3.4
!DATA_LAT
  Top 0.254: U10.6 310.07,73.98 316.48,67.56 319.28,67.56 319.79,68.07 319.79,71.37 323.6,75.18 328.17,75.18 | 328.17,75.18 329.18,75.18 345.19,75.18 345.44,74.93 355.09,65.28 355.09,42.67 354.08,41.66 330.96,41.66 329.31,40.01 U5.12 | 329.31,79.38 329.31,79.25 | 329.31,79.25 329.31,75.18 328.17,75.18 | U3.12 329.31,79.25
AC_17
  Top 0.178: IC2.49 113.71,106.19 111.36,108.54 111.12,108.54 109.31,110.35 109.31,129.38 111.68,131.75 111.68,133.93 108.05,137.57 AUX_PORT.P$3
AC_33  (via drill 0.5 pad 0.8)
  Top 0.178: IC2.100 123.8,90.96 129.77,90.96 v131.06,89.66
  Top 0.254: v135.64,115.57 135.64,119.89 115.98,139.55 AUX_PORT.P$5
  Bottom 0.254: v135.64,115.57 135.64,94.66 131.06,90.09 v131.06,89.66
AC_34  (via drill 0.5 pad 0.8)
  Top 0.178: IC2.99 122.51,90.96 123.05,90.42 129.03,90.42 v129.79,89.66
  Top 0.254: v134.37,115.57 134.37,118.36 112.01,140.71 AUX_PORT.P$4
  Bottom 0.254: v129.79,89.66 134.37,94.23 v134.37,115.57
AC_44
  Top 0.178: IC2.29 121.71,106.5 123.16,107.95 123.96,107.95 126.31,110.3 126.31,125.85 109.98,142.18 109.98,146.66 108.8,147.85 106.14,147.85 AUX_PORT.P$2
AC_46  (via drill 0.5 pad 0.8)
  Top 0.178: IC2.88 118.11,89.3 122.83,84.58 v123.19,84.58
  Top 0.254: v134.62,122.17 118.11,138.68 118.11,146.24 115.68,148.67 103,148.67 AUX_PORT.P$1
  Bottom 0.254: v123.19,84.58 133.35,94.74 133.35,120.9 v134.62,122.17
AUX_0
  Top 0.254: U11.11 332.27,102.23 331.98,101.94 331.98,101.35 331.98,95.77 328.42,92.22 TCBTWDN_PORT.3 R35.1
AUX_1
  Top 0.254: U11.12 332.27,103.5 331.22,102.45 331.22,97.55 325.88,92.22 TCBTWDN_PORT.4 R36.1
AUX_2
  Top 0.254: U11.13 332.27,104.78 328.93,101.43 328.93,96.77 324.37,92.22 | R37.1 TCBTWDN_PORT.5 324.37,92.22 | 324.37,92.22
AUX_3
  Top 0.254: U11.3 326.07,106.05 313.18,93.15 TCBTWDN_PORT.9 R39.1
AUX_4
  Top 0.254: U11.4 326.07,104.78 315.72,94.42 TCBTWDN_PORT.8 R40.1
AUX_5
  Top 0.254: U11.5 326.07,103.5 318.26,95.69 318.26,92.22 TCBTWDN_PORT.7 R41.1
AUX_6
  Top 0.254: R42.1 TCBTWDN_PORT.6 320.8,92.22 325.63,97.04 325.63,101.09 325.63,101.35 326.52,102.23 U11.6
AVCC
  Top 0.178: IC2.30 121.31,106.58 121.31,106.83 122.94,108.46 123.19,108.46 124.08,109.35 | 123.81,109.08 124.08,109.35 | 124.08,109.35 125.61,110.88 C9.1 C8.1 R3.2
BT_RESET  (via drill 0.5)
  Top 0.254: SW4.1 76.85,128.36 76.85,130.05 | 76.85,130.05 R138.2 | BT1.5 176.02,104.92 v176.02,112.78 | v105.16,121.92 100.33,126.75 83.06,126.75 79.76,130.05 76.85,130.05
  Bottom 0.254: v176.02,112.78 163.32,112.78 152.4,123.7 127,123.7 125.22,121.92 v105.16,121.92
BT_RX
  Top 0.254: BT1.13 167.64,90.43 167.13,89.92 162.81,89.92 161.29,91.44 BT_RX.1
BT_TX
  Top 0.254: BT1.14 168.84,90.1 167.64,88.9 BT_TX.1
COIN
  Top 0.254: U12.5 328.63,121.29 330.07,119.85 330.07,118.03 339.08,109.02 CABINET.P$6 344.73,108.97 R49.1
COMM_ATN  (via drill 0.5 pad 0.8)
  Top 0.178: IC2.39 117.71,108.1 117.44,108.37 117.44,121.25 v120.9,124.71
  Top 0.254: U1.31 293.51,123.56 292.86,124.21 289.56,124.21 v285.5,128.27
  Bottom 0.254: 284.73,127.51 285.11,127.89 | 285.11,127.89 v285.5,128.27 | v120.9,124.71 123.44,124.71 124.21,125.48 155.19,125.48 156.97,127.25 284.48,127.25 285.11,127.89
COMM_CLK  (via drill 0.5 pad 0.8)
  Top 0.178: v119.13,123.95 117.04,121.87 117.04,108.26 117.31,107.99 IC2.40
  Top 0.254: U1.32 292.71,123.34 292.35,123.7 289.31,123.7 286,127 v285.5,127
  Bottom 0.254: 285.24,126.75 v285.5,127 285.24,126.75 | v119.13,123.95 123.7,123.95 124.46,124.71 155.19,124.71 157.23,126.75 285.24,126.75
COMM_DATA  (via drill 0.5 pad 0.8)
  Top 0.178: v111,132.33 108.93,130.26 108.93,110.07 110.79,108.2 111,108.2 113.31,105.89 IC2.50
  Top 0.254: v128.52,132.33 v146.05,114.81 | U1.33 291.91,122.87 291.59,123.19 289.05,123.19 286.51,125.73 v285.5,125.73
  Bottom 0.254: v146.05,114.81 150.88,109.98 269.75,109.98 v285.5,125.73 | v111,132.33 v128.52,132.33
D1
  Top 0.254: R5.2 PROP_USB.CATHODE
D2
  Top 0.254: R6.2 PROP_RX.CATHODE
D3
  Top 0.254: R15.2 PROP_TX.CATHODE
D+
  Top 0.254: J2.D+ 281.69,150.11 279.91,148.34 279.91,145.68 R181.2
D-
  Top 0.254: J2.D- 282.49,145.64 R180.2
DATA_CAB  (via drill 0.5 pad 0.8)
  Top 0.178: IC2.87 117.71,89.09 122.98,83.82 123.44,83.82 123.7,84.07 124.97,84.07 v125.22,83.82
  Top 0.254: v336.3,99.57 336.17,99.7 U11.9
  Bottom 0.254: v336.3,99.57 335.79,99.06 302.01,99.06 291.66,88.71 291.59,88.65 289.31,88.65 286.77,86.11 203.2,86.11 155.45,86.11 154.05,87.5 152.84,88.71 152.09,88.71 151.48,88.71 146.59,83.82 | 146.59,83.82 | 146.59,83.82 v125.22,83.82
DATA_CAB1  (via drill 0.5)
  Top 0.254: U12.9 337.44,117.48 v337.82,117.86 | v336.8,102.36 335.41,100.97 U11.10
  Bottom 0.254: v337.82,117.86 337.82,103.38 v336.8,102.36
DATA_CLK  (via drill 0.5, 0.5 pad 0.8)
  Top 0.178: IC2.93 120.11,90.14 122.88,87.38 125.98,87.38 139.95,73.41 v228.85,73.41
  Top 0.254: v324.87,97.79 324.87,101.6 326.14,102.87 328.68,102.87 329.18,103.38 329.18,107.19 | 329.18,107.19 329.18,108.71 326.14,111.76 325.63,112.27 325.63,116.84 325.63,124.46 326.26,125.1 U12.2 | U11.2 329.06,107.32 arc-90 329.18,107.19 | v327.15,83.06 329.69,83.06 330.45,82.3 330.58,82.17 U3.11 330.58,77.34 331.22,76.71 344.42,76.71 355.6,65.53 355.6,42.42 354.33,41.15 331.47,41.15 330.71,40.39 330.58,40.26 U5.11
  Bottom 0.254: v228.85,73.41 287.02,73.41 296.42,82.8 303.28,82.8 310.9,82.8 326.9,82.8 v327.15,83.06 329.69,85.6 329.69,88.65 329.69,92.96 v324.87,97.79
DATA_LAT  (via drill 0.5, 0.5 pad 0.8)
  Top 0.178: v290.07,85.6 v290.07,89.66 | IC2.12 131.12,98.15 148.14,81.14 251.83,81.14 v254,83.31
  Top 0.254: U11.1 324.99,108.58 v324.87,108.46 324.87,125.48 325.75,126.36 U12.1 | v308.61,85.6 310.07,84.14 U10.1
  Bottom 0.203: v254,83.31 254.25,83.57 288.29,83.57 290.07,85.34 v290.07,85.6
  Bottom 0.254: v308.61,85.6 v290.07,85.6 | v290.07,89.66 299.97,99.57 316.51,99.57 324.87,107.92 v324.87,108.46
DM
  Top 0.254: IC1.16 72.39,142.51 75.73,145.86 J1.D-
DOOR
  Top 0.254: R43.1 CABINET.P$9 343.79,120.02 U12.11
DP
  Top 0.254: IC1.15 72.3,143.16 72.64,143.51 72.64,147.57 74.93,149.86 J1.D+
ENTER
  Top 0.254: U12.4 328.63,122.55 331.47,119.72 331.47,117.24 335.74,112.98 CABINET.P$7 344.88,112.78 R48.1
FT232_RESET
  Top 0.254: IC1.19 69.19,140.56 68.33,139.7 68.33,134.11 69.34,133.1 72.55,133.1 73.04,132.61 R139.1 72.92,131.46 SW4.3 72.9,128.25
FT_3.3V  (via drill 0.5)
  Top 0.254: C19.1 83,136.65 82.99,136.66 IC1.4 77.46,136.66 76.96,137.16 76.96,144.02 77.72,144.78 v79.25,144.78 79.5,144.78 80.01,144.27 85.09,144.27 85.34,144.02 87.88,144.02 88.39,144.53 88.39,148.84 88.93,149.39 PIC_RX.ANODE PIC_TX.ANODE | IC1.17 72.78,141.86 72.9,141.99 73.41,142.49 v74.17,143.26
  Bottom 0.254: v74.17,143.26 75.69,144.78 v79.25,144.78
GI_0
  Top 0.254: R99.1 318.52,70.1 318.52,70.87 323.34,75.69 324.87,75.69 325.5,76.33 U3.15
GI_1
  Top 0.254: R101.1 324.23,71.64 U3.1
GI_2
  Top 0.254: R103.1 325.5,70.37 U3.2
GI_3
  Top 0.254: R105.1 326.77,69.1 U3.3
GI_4
  Top 0.254: R107.1 328.04,69.1 U3.4
GI_5
  Top 0.254: R109.1 329.31,70.37 U3.5
GI_6
  Top 0.254: R111.1 330.58,71.64 U3.6
GI_7
  Top 0.254: U3.7 331.85,72.52 331.85,71.75 332.99,70.61 334.15,70.61 R113.1
GI_8
  Top 0.254: U5.15 325.5,35.18 324.87,34.54 324.1,34.54 318.52,28.96 318.01,28.45 R125.1
GI_9
  Top 0.254: U5.1 324.23,31.12 323.09,29.97 322.44,29.97 R126.1
GI_10
  Top 0.254: U5.2 325.5,31.12 323.09,28.7 R127.1
GI_11
  Top 0.254: U5.3 326.77,30.35 325.63,29.21 R128.1
GI_12
  Top 0.254: U5.4 328.04,28.2 R129.1
GI_13
  Top 0.254: U5.5 329.31,30.61 330.71,29.21 R130.1
GI_14
  Top 0.254: U5.6 330.58,31.37 333.25,28.7 R131.1
GI_15
  Top 0.254: U5.7 331.85,31.37 334.26,28.96 335.53,28.96 335.79,28.7 R132.1
GI_DATA_COL  (via drill 0.5)
  Top 0.178: IC2.11 130.91,97.75 147.92,80.75 252.71,80.75 v254,82.04 | 295.13,80.75 296.63,79.25 316.74,79.25 320.04,82.55 325.63,82.55 326.77,81.41 U3.14
  Top 0.203: v291.34,82.04 293.83,82.04 295.13,80.75
  Bottom 0.203: v254,82.04 v291.34,82.04
GI_DATA_COL_B
  Top 0.254: U3.9 342.34,79.55 356.11,65.79 356.11,38.06 353.61,35.56 328.68,35.56 326.77,37.47 U5.14
GI_R_0
  Top 0.61: U6.D 305.56,60.71 307.09,59.18 307.09,51.21 GI_0.P$1
GI_R_1
  Top 0.61: U7.D 312.42,60.71 313.44,59.69 313.44,48.82 GI_0.P$2
GI_R_2
  Top 0.61: U8.D 318.77,60.71 319.79,59.69 319.79,48.06 GI_0.P$3
GI_R_3
  Top 0.61: U9.D 325.63,60.71 326.39,59.94 326.39,50.7 GI_0.P$4
GI_R_4
  Top 0.61: U40.D 331.72,60.71 332.74,59.69 332.74,53.09 GI_0.P$5
GI_R_5
  Top 0.61: U41.D 338.33,60.71 339.09,59.94 339.09,55.47 GI_0.P$6
GI_R_6
  Top 0.61: U42.D 344.42,60.71 345.19,59.94 345.19,54.86 343.66,53.34 340.92,53.34 GI_0.P$7
GI_R_7
  Top 0.61: U43.D 350.77,60.71 351.79,59.69 351.79,54.61 349.5,52.32 347.22,52.32 346.2,52.32 343.86,52.32 GI_0.P$8
GI_R_8
  Top 0.61: U44.D 305.82,20.07 307.09,18.8 307.09,10.31 GI_1.P$1
GI_R_9
  Top 0.61: U45.D 312.17,20.07 313.18,19.05 313.18,8.18 GI_1.P$2
GI_R_10
  Top 0.61: U46.D 318.52,20.07 319.53,19.05 319.53,7.42 GI_1.P$3
GI_R_11
  Top 0.61: U47.D 324.87,20.07 325.88,19.05 325.88,9.8 GI_1.P$4
GI_R_12
  Top 0.61: U48.D 330.45,20.07 331.98,18.54 331.98,11.94 GI_1.P$5
GI_R_13
  Top 0.61: U49.D 336.8,20.07 338.33,18.54 338.33,14.33 GI_1.P$6
GI_R_14
  Top 0.61: U50.D 343.41,20.07 344.68,18.8 344.68,13.97 342.9,12.19 340.16,12.19 GI_1.P$7
GI_R_15
  Top 0.61: U51.D 350.01,20.07 351.28,18.8 351.28,13.97 347.22,9.91 341.83,9.91 GI_1.P$8
GND  (via drill 0.5, 0.5 pad 0.8, 0.8)
  Top 0.178: IC1.21 69.85,139.26 69.85,139.19 | IC1.25 69.6,136.66 69.85,136.65 | IC2.65 113.28,97.75 113.28,97.79 | IC2.75 111.44,93.73 113.54,93.73 | C7.2 113.54,110.37 113.54,109.22 115.31,107.45 IC2.45 115.31,104.15 115.57,103.89 | 119.38,103.63 118.91,104.1 IC2.36 118.91,110.27 119.38,110.74 123.56,110.74 C9.2 | C2.2 121.3,110.74 121.16,110.74 | IC2.31 | IC2.31 120.9,107.19 121.67,107.95 | IC2.31 120.9,99.31 121.67,98.55 122.94,98.55 123.74,99.35 IC2.15 131.46,99.35 | 131.46,99.35 132.33,99.35 132.33,99.82 | C3.2 131.46,99.35
  other vias: 126.75,93.22 126.75,92.2 253.75,117.86 247.4,114.05 246.13,117.86 185.17,121.67 186.69,121.67 80.01,146.81 122.68,111.25 127.25,111.25 142.49,103.63 142.75,97.79 142.75,63.75 149.61,63.75 156.46,63.75 162.05,63.75 168.91,63.75 175.51,63.75 188.21,63.75 181.86,63.75 194.82,63.75 219.71,64.26 226.82,64.26 233.68,64.26 239.52,64.26 246.13,64.52 251.46,64.52 147.07,98.55 113.79,83.57 113.79,82.04 113.79,85.34 124.21,83.31 109.73,92.71 110.49,91.69 132.84,90.17 133.1,87.88 134.62,85.34 138.94,81.28 144.27,75.95 140.46,77.98 148.34,77.98 156.97,77.98 147.07,94.74 143.26,95 104.39,114.3 104.39,113.03 113.28,78.99 113.28,74.93 146.81,105.16 144.27,110.49 132.46,111.19 132.46,109.16 132.46,107.38 129.41,102.81 131.44,102.81 132.46,99.76 124.97,91.69 113.28,93.73 121.92,98.55 120.9,103.12 116.08,102.36 114.05,97.79 118.11,99.82 118.11,97.28 116.84,98.55 119.38,98.55 291.08,125.22 287.37,129.57 295.94,117.28 295.94,114.74 294.67,116.01 297.21,116.01 296.96,123.89 298.23,123.89 305.59,122.36 305.59,121.09 310.17,115 149.1,50.55 168.15,50.29 187.45,50.29 206.76,50.29 226.06,50.29 245.36,50.29 7.87,136.14 7.87,132.59 49.78,132.59 49.78,135.89 51.05,142.75 53.59,142.75 49.53,146.3 7.62,126.24 7.62,123.95 49.78,123.7 49.78,125.98 49.02,128.78 6.35,129.03 288.29,138.43 283.21,138.94 69.09,141.99 162.31,108.46 173.48,108.46 122.68,114.05 127.25,114.05
  pour Bottom: -1.52,151.89 359.16,151.89 359.16,-0.51 296.93,-0.51 296.93,45.47 293.12,49.02 293.12,65.28 260.35,65.28 260.35,49.02 111.51,49.02 111.51,-1.78 -1.52,-0.51
  pour Top: -1.52,151.89 359.16,151.89 359.16,-0.51 296.93,-0.51 296.93,45.47 293.12,49.02 293.12,65.28 260.35,65.28 260.35,49.02 111.51,49.02 111.51,-0.51 -1.52,-0.51
I2C_SCL  (via drill 0.5, 0.5 pad 0.8)
  Top 0.178: IC2.66 105.23,97.35 102.16,94.28 87.9,94.28 84.33,97.86 v84.33,119.13
  Top 0.254: v137.16,135.38 137.16,143.51 AUX_PORT.P$11
  Bottom 0.254: v84.33,119.13 90.68,119.13 104.65,133.1 134.87,133.1 v137.16,135.38
I2C_SDA  (via drill 0.5, 0.5 pad 0.8)
  Top 0.178: IC2.67 105.59,96.95 102.51,93.88 87.46,93.88 83.31,98.02 v83.31,119.13
  Top 0.254: v135.64,135.38 AUX_PORT.P$10
  Bottom 0.254: AUX_PORT.P$10 135.64,145.57 | v83.31,119.13 83.31,119.38 83.82,119.89 90.42,119.89 104.14,133.6 133.86,133.6 v135.64,135.38
L_FLIP
  Top 0.254: U12.14 336.17,123.83 CABINET.P$12 R46.1
LIGHT_C_0
  Top 0.406: U20.D 16.76,71.12 18.29,69.6 18.29,54.81 LIGHT_COL.P$3
LIGHT_C_1
  Top 0.406: U21.D 21.59,82.8 22.35,82.04 22.35,77.47 21.34,76.45 21.34,55.73 LIGHT_COL.P$4
LIGHT_C_2
  Top 0.406: U22.D 26.42,71.12 27.43,70.1 27.43,55.12 LIGHT_COL.P$5
LIGHT_C_3
  Top 0.406: U23.D 30.73,82.8 32,81.53 32,77.98 29.97,75.95 29.97,55.02 LIGHT_COL.P$6
LIGHT_C_4
  Top 0.406: U24.D 35.05,71.12 36.58,69.6 36.58,56.34 LIGHT_COL.P$7
LIGHT_C_5
  Top 0.406: U25.D 40.39,82.8 41.66,81.53 41.66,77.47 38.61,74.42 38.61,54.41 LIGHT_COL.P$8
LIGHT_C_6
  Top 0.406: U26.D 45.72,71.12 46.74,70.1 46.74,58.57 LIGHT_COL.P$9
LIGHT_C_7
  Top 0.406: LIGHT_COL.P$10 50.32,58.34 50.8,58.83 50.8,82.04 50.04,82.8 U27.D
LIGHT_C_B_0
  Top 0.406: R84.2 14.48,89.27 | 14.48,89.27 R83.2 | U20.G 14.48,89.27
LIGHT_C_B_1
  Top 0.406: 19.3,89.27 R85.2 | R86.2 19.3,89.27 | U21.G 19.3,89.27
LIGHT_C_B_2
  Top 0.406: U22.G 24.13,89.27 | 24.13,89.27 R87.2 | R88.2 24.13,89.27
LIGHT_C_B_3
  Top 0.406: 28.96,89.27 R89.2 | U23.G 28.96,89.27 | R90.2 28.96,89.27
LIGHT_C_B_4
  Top 0.406: 33.78,89.27 R91.2 | 33.78,89.27 R92.2 | U24.G 33.78,89.27
LIGHT_C_B_5
  Top 0.406: U25.G 38.61,89.27 | 38.61,89.27 R93.2 | R94.2 38.61,89.27
LIGHT_C_B_6
  Top 0.406: U26.G 43.43,89.27 | 43.43,89.27 R95.2 | R96.2 43.43,89.27
LIGHT_C_B_7
  Top 0.406: U27.G 48.26,89.27 | 48.26,89.27 R97.2 | R98.2 48.26,89.27
LIGHT_DTA_0
  Top 0.406: R84.1 13.21,91.83 18.16,96.77 22.61,96.77 IC5.11
LIGHT_DTA_1
  Top 0.406: IC5.12 22.35,93.98 19.81,93.98 18.03,92.2 R86.1
LIGHT_DTA_2
  Top 0.406: IC5.13 22.86,91.95 R88.1
LIGHT_DTA_3
  Top 0.406: IC5.14 27.69,94.23 R90.1
LIGHT_DTA_4
  Top 0.406: IC5.15 32.51,96.52 R92.1
LIGHT_DTA_5
  Top 0.406: IC5.16 37.34,98.81 R94.1
LIGHT_DTA_6
  Top 0.406: IC5.17 42.16,98.55 R96.1
LIGHT_DTA_7
  Top 0.406: IC5.18 47.24,96.01 R98.1
LIGHT_R_0
  Top 0.406: U28.D 16.76,26.16 18.54,24.38 18.54,14.48 16.89,12.83 16.89,8.71 LIGHT_ROW.P$2
LIGHT_R_1
  Top 0.406: LIGHT_ROW.P$4 22.71,6.49 20.83,8.37 20.83,18.68 20.83,30.23 21.84,31.24 21.84,36.32 20.57,37.59 U29.D
LIGHT_R_2
  Top 0.406: U30.D 25.91,26.16 26.92,25.15 26.92,18.17 26.92,6.86 LIGHT_ROW.P$5
LIGHT_R_3
  Top 0.406: LIGHT_ROW.P$6 30.63,6.44 30.48,6.59 30.48,30.23 31.5,31.24 31.5,36.83 30.73,37.59 U31.D
LIGHT_R_4
  Top 0.406: 34.54,6.66 LIGHT_ROW.P$7 36.58,8.59 36.58,18.93 36.58,25.15 35.56,26.16 U32.D
LIGHT_R_5
  Top 0.406: 38.61,6.66 LIGHT_ROW.P$8 38.61,6.66 | U33.D 40.39,37.59 41.15,36.83 41.15,31.75 38.61,29.21 38.61,6.66
LIGHT_R_6
  Top 0.406: 42.42,6.71 LIGHT_ROW.P$9 42.52,7.23 46.23,10.93 46.23,25.15 45.21,26.16 U34.D
LIGHT_R_7
  Top 0.406: 46.48,6.76 LIGHT_ROW.P$10 46.33,6.97 50.8,11.44 50.8,36.83 50.04,37.59 U35.D
MENU
  Top 0.254: U12.3 328.63,123.83 331.98,120.48 331.98,117.37 333.35,116 343.73,116 CABINET.P$8 344.78,116.84 R47.1
N$1
  Top 0.254: R9.2 90.17,147.07 PIC_RX.CATHODE
N$2
  Top 0.254: R7.2 PIC_TX.CATHODE
N$3
  Top 0.254: PROP_ACT.CATHODE 281.04,125.07 R30.2
N$4
  Top 0.254: IC1.1 83.42,129.79 R2.1
N$5
  Top 0.203: C10.1 116.08,85.88 116.91,86.71 IC2.85
N$6
  Top 0.254: IC1.5 82.06,137.31 R1.1
N$7
  Top 0.254: R9.1 90.17,142.18 91.62,140.74 91.95,140.41 91.95,131.57 89.06,128.68 88.51,128.68 83.15,128.68 82.64,128.68 74.68,136.65 72.72,138.61 72.64,138.61 IC1.22
N$8
  Top 0.254: IC1.2 80.14,135.36 83,132.5 83.43,132.08 C1.1
N$9
  Top 0.254: R8.1 121.67,77.22 120.9,77.98 120.25,77.98 SW1.P$3
N$11
  Top 0.254: IC1.23 72.06,137.96 72.1,137.92 72.64,137.92 82.55,128.02 83.31,128.02 | 82.8,128.02 83.31,128.02 | 83.31,128.02 88.39,128.02 88.53,128.02 89.41,128.02 92.71,131.32 93.47,132.08 R7.1
N$12
  Top 0.254: R11.2 PIC_USB.CATHODE
N$13
  Top 0.406: U28.G R100.2
N$15
  Top 0.406: U29.G R102.2
N$19
  Top 0.254: R23.2 238.76,113.34 238.78,113.36 SD0.9
N$21
  Top 0.406: U30.G R104.2
N$22
  Top 0.254: U38.8 156.97,114.87 160.72,118.62 164.53,118.62 165.5,119.59 166.37,120.46 166.37,123.7 165.22,124.85 R119.1 163.18,124.85 158.5,129.54 158.5,134.11 156.97,135.64 RGB_0.G
N$23
  Top 0.254: U38.9 158.24,114.87 160.21,116.84 163.6,116.84 164.59,116.84 169.67,121.92 169.67,124.46 169.42,124.71 169.28,124.85 R120.1 165.86,127.39 165.86,134.37 164.59,135.64 RGB_1.G
N$24
  Top 0.254: R21.2 258.57,112.58 257.91,113.24 SD0.8
N$25
  Top 0.254: U38.10 159.51,115.32 160.27,116.08 164.84,116.08 170.43,121.67 170.43,124.21 170.94,124.71 172.07,124.71 R121.1 172.72,125.36 172.72,134.62 171.7,135.64 RGB_2.G
N$26
  Top 0.254: U36.10 186.44,115.14 182.12,119.46 182.12,124.46 182.51,124.85 R124.1 190.89,124.85 195.58,129.54 195.58,134.87 194.82,135.64 RGB_5.G
N$28